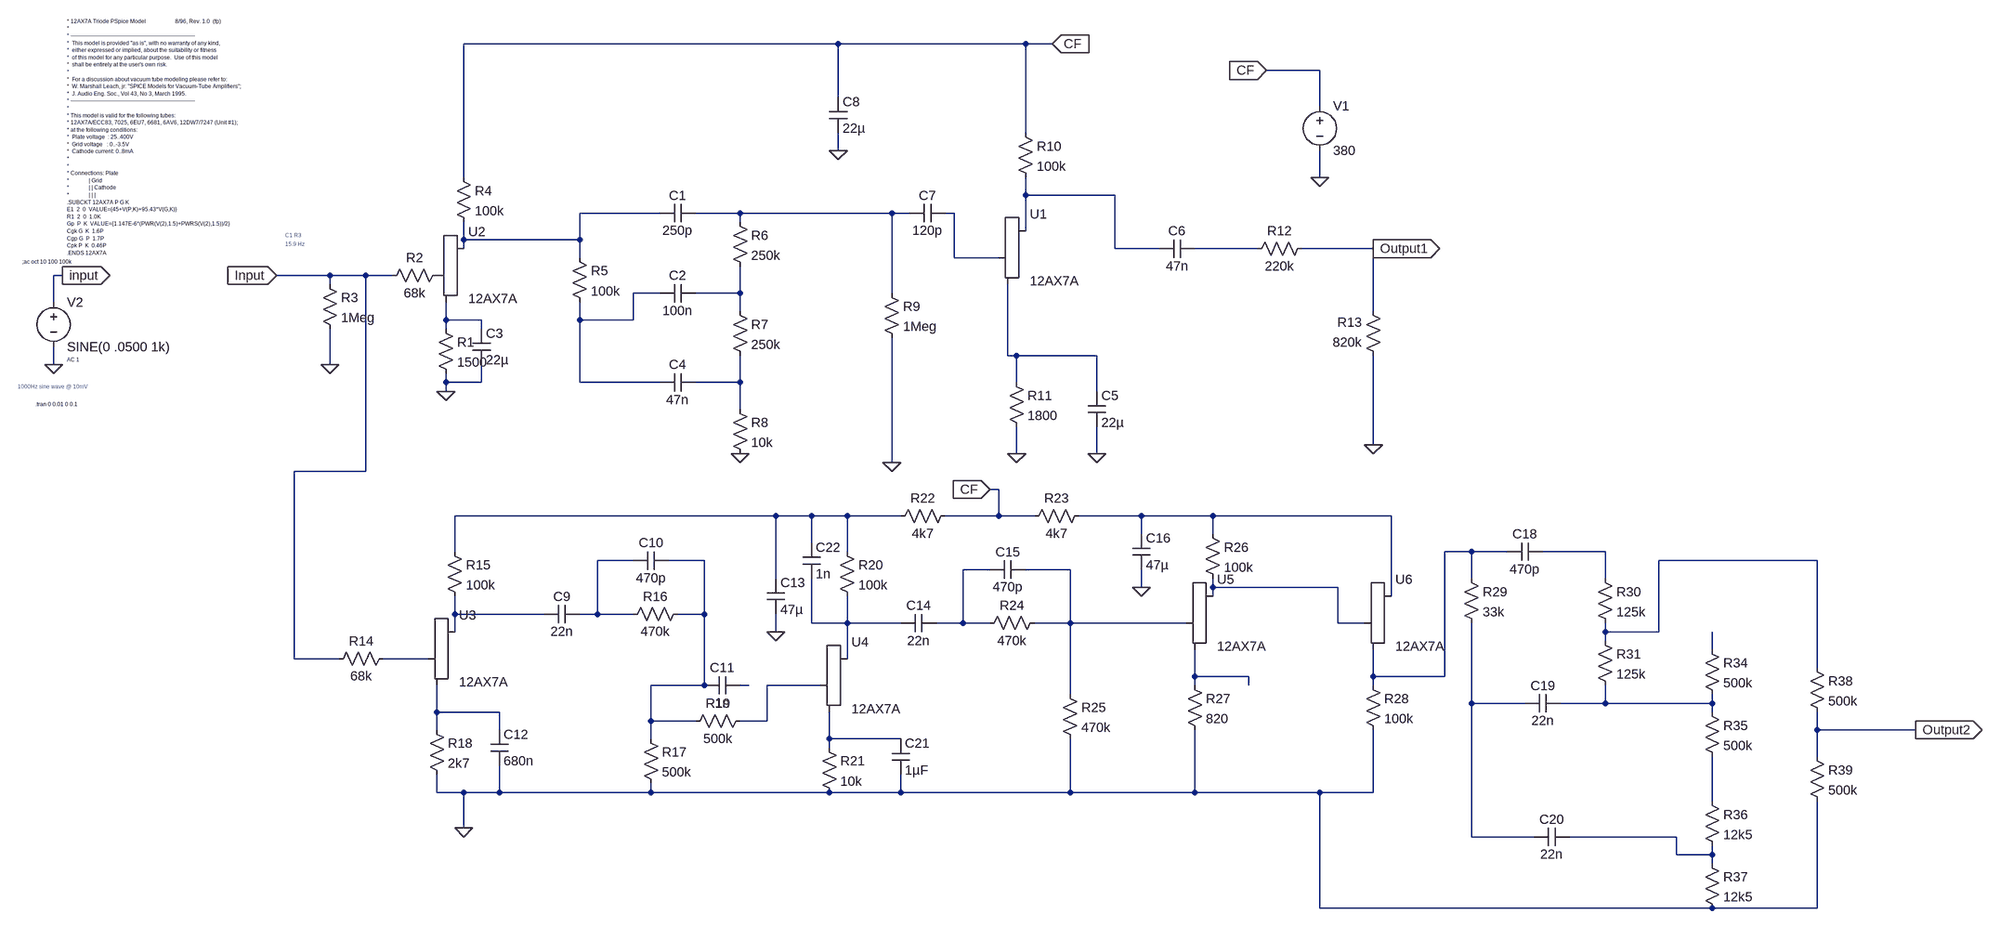
[diagram p0: schematic AAA_preamp1 v3 sin mods.asc]
AAA_preamp1 v3 sin mods.asc, the LTspice schematic file:
Version 4
SHEET 1 3276 1272
WIRE 1120 -288 448 -288
WIRE 1456 -288 1120 -288
WIRE 1504 -288 1456 -288
WIRE 1984 -240 1888 -240
WIRE 1120 -192 1120 -288
WIRE 1984 -176 1984 -240
WIRE 1456 -128 1456 -288
WIRE 1120 -96 1120 -128
WIRE 448 -48 448 -288
WIRE 1984 -48 1984 -96
WIRE 1456 -16 1456 -48
WIRE 1616 -16 1456 -16
WIRE 800 16 656 16
WIRE 944 16 864 16
WIRE 1216 16 944 16
WIRE 1248 16 1216 16
WIRE 1328 16 1312 16
WIRE 944 32 944 16
WIRE 1456 48 1456 -16
WIRE 448 64 448 32
WIRE 656 64 656 16
WIRE 656 64 448 64
WIRE 448 80 448 64
WIRE 1616 80 1616 -16
WIRE 1696 80 1616 80
WIRE 1872 80 1760 80
WIRE 2080 80 1952 80
WIRE 656 96 656 64
WIRE 1328 96 1328 16
WIRE 1408 96 1328 96
WIRE -272 128 -288 128
WIRE 208 128 112 128
WIRE 272 128 208 128
WIRE 320 128 272 128
WIRE 208 144 208 128
WIRE 800 160 752 160
WIRE 944 160 944 112
WIRE 944 160 864 160
WIRE 1216 160 1216 16
WIRE -288 176 -288 128
WIRE 944 192 944 160
WIRE 2080 192 2080 80
WIRE 416 208 416 176
WIRE 480 208 416 208
WIRE 656 208 656 176
WIRE 752 208 752 160
WIRE 752 208 656 208
WIRE 416 224 416 208
WIRE 480 224 480 208
WIRE 1424 272 1424 144
WIRE 1440 272 1424 272
WIRE 1584 272 1440 272
WIRE -288 288 -288 256
WIRE 208 288 208 224
WIRE 416 320 416 304
WIRE 480 320 480 288
WIRE 480 320 416 320
WIRE 656 320 656 208
WIRE 800 320 656 320
WIRE 944 320 944 272
WIRE 944 320 864 320
WIRE 1440 320 1440 272
WIRE 416 336 416 320
WIRE 1584 336 1584 272
WIRE 944 368 944 320
WIRE 2080 432 2080 272
WIRE 1440 448 1440 400
WIRE 1584 448 1584 400
WIRE 1216 464 1216 240
WIRE 272 480 272 128
WIRE 272 480 144 480
WIRE 1408 512 1392 512
WIRE 1008 560 432 560
WIRE 1072 560 1008 560
WIRE 1136 560 1072 560
WIRE 1232 560 1136 560
WIRE 1408 560 1408 512
WIRE 1408 560 1312 560
WIRE 1472 560 1408 560
WIRE 1664 560 1552 560
WIRE 1792 560 1664 560
WIRE 2112 560 1792 560
WIRE 1664 592 1664 560
WIRE 1792 592 1792 560
WIRE 1072 608 1072 560
WIRE 432 624 432 560
WIRE 1136 624 1136 560
WIRE 2256 624 2208 624
WIRE 2320 624 2256 624
WIRE 2496 624 2384 624
WIRE 752 640 688 640
WIRE 880 640 816 640
WIRE 2928 640 2592 640
WIRE 1392 656 1344 656
WIRE 1536 656 1456 656
WIRE 1008 672 1008 560
WIRE 2256 672 2256 624
WIRE 2496 672 2496 624
WIRE 1664 688 1664 656
WIRE 1792 688 1792 672
WIRE 2016 688 1792 688
WIRE 1792 704 1792 688
WIRE 2112 704 2112 560
WIRE 432 736 432 704
WIRE 592 736 432 736
WIRE 688 736 688 640
WIRE 688 736 656 736
WIRE 752 736 688 736
WIRE 880 736 880 640
WIRE 880 736 832 736
WIRE 1072 752 1072 672
WIRE 1136 752 1136 704
WIRE 1136 752 1072 752
WIRE 1232 752 1136 752
WIRE 1344 752 1344 656
WIRE 1344 752 1296 752
WIRE 1392 752 1344 752
WIRE 1536 752 1536 656
WIRE 1536 752 1472 752
WIRE 1744 752 1536 752
WIRE 2016 752 2016 688
WIRE 2064 752 2016 752
WIRE 432 768 432 736
WIRE 1008 768 1008 736
WIRE 2496 768 2496 752
WIRE 2592 768 2592 640
WIRE 2592 768 2496 768
WIRE 2496 784 2496 768
WIRE 2688 800 2688 768
WIRE 144 816 144 480
WIRE 224 816 144 816
WIRE 384 816 304 816
WIRE 1136 816 1136 752
WIRE 2928 832 2928 640
WIRE 1760 848 1760 800
WIRE 1856 848 1760 848
WIRE 2080 848 2080 800
WIRE 2208 848 2208 624
WIRE 2208 848 2080 848
WIRE 880 864 880 736
WIRE 880 864 784 864
WIRE 960 864 944 864
WIRE 1088 864 992 864
WIRE 1760 864 1760 848
WIRE 1856 864 1856 848
WIRE 2080 864 2080 848
WIRE 1536 880 1536 752
WIRE 2256 896 2256 752
WIRE 2352 896 2256 896
WIRE 2496 896 2496 864
WIRE 2496 896 2416 896
WIRE 2688 896 2688 880
WIRE 2688 896 2496 896
WIRE 400 912 400 864
WIRE 512 912 400 912
WIRE 2688 912 2688 896
WIRE 784 928 784 864
WIRE 864 928 784 928
WIRE 992 928 992 864
WIRE 992 928 944 928
WIRE 400 944 400 912
WIRE 512 944 512 912
WIRE 2928 944 2928 912
WIRE 3120 944 3120 928
WIRE 3120 944 2928 944
WIRE 784 960 784 928
WIRE 1104 960 1104 912
WIRE 1232 960 1104 960
WIRE 1104 976 1104 960
WIRE 2928 992 2928 944
WIRE 400 1056 400 1024
WIRE 448 1056 400 1056
WIRE 512 1056 512 1008
WIRE 512 1056 448 1056
WIRE 784 1056 784 1040
WIRE 784 1056 512 1056
WIRE 1104 1056 784 1056
WIRE 1232 1056 1232 1024
WIRE 1232 1056 1104 1056
WIRE 1536 1056 1536 960
WIRE 1536 1056 1232 1056
WIRE 1760 1056 1760 944
WIRE 1760 1056 1536 1056
WIRE 1984 1056 1760 1056
WIRE 2080 1056 2080 944
WIRE 2080 1056 1984 1056
WIRE 2688 1072 2688 992
WIRE 448 1120 448 1056
WIRE 2256 1136 2256 896
WIRE 2368 1136 2256 1136
WIRE 2624 1136 2432 1136
WIRE 2624 1168 2624 1136
WIRE 2688 1168 2688 1152
WIRE 2688 1168 2624 1168
WIRE 2688 1184 2688 1168
WIRE 1984 1264 1984 1056
WIRE 2688 1264 1984 1264
WIRE 2928 1264 2928 1072
WIRE 2928 1264 2688 1264
FLAG 208 288 0
FLAG -288 288 0
FLAG 416 336 0
FLAG -272 128 input
IOPIN -272 128 Out
FLAG 112 128 Input
IOPIN 112 128 In
FLAG 944 448 0
FLAG 1216 464 0
FLAG 1440 448 0
FLAG 1584 448 0
FLAG 2080 432 0
FLAG 2080 80 Output1
IOPIN 2080 80 Out
FLAG 1984 -48 0
FLAG 1120 -96 0
FLAG 1888 -240 CF
IOPIN 1888 -240 In
FLAG 1504 -288 CF
IOPIN 1504 -288 In
FLAG 448 1120 0
FLAG 1008 768 0
FLAG 1392 512 CF
IOPIN 1392 512 In
FLAG 1664 688 0
FLAG 3120 944 Output2
IOPIN 3120 944 Out
SYMBOL Misc\\triode 448 128 R0
SYMATTR InstName U2
SYMATTR Value 12AX7A
SYMBOL res 400 208 R0
SYMATTR InstName R1
SYMATTR Value 1500
SYMBOL res 192 128 R0
SYMATTR InstName R3
SYMATTR Value 1Meg
SYMBOL voltage -288 160 R0
WINDOW 123 24 120 Left 0
WINDOW 39 0 0 Left 0
SYMATTR Value2 AC 1
SYMATTR InstName V2
SYMATTR Value SINE(0 .0500 1k)
SYMBOL cap 464 224 R0
SYMATTR InstName C3
SYMATTR Value 22µ
SYMBOL res 416 112 R90
WINDOW 0 0 56 VBottom 2
WINDOW 3 32 56 VTop 2
SYMATTR InstName R2
SYMATTR Value 68k
SYMBOL res 432 -64 R0
SYMATTR InstName R4
SYMATTR Value 100k
SYMBOL res 640 80 R0
SYMATTR InstName R5
SYMATTR Value 100k
SYMBOL cap 864 0 R90
WINDOW 0 0 32 VBottom 2
WINDOW 3 32 32 VTop 2
SYMATTR InstName C1
SYMATTR Value 250p
SYMBOL cap 864 144 R90
WINDOW 0 0 32 VBottom 2
WINDOW 3 32 32 VTop 2
SYMATTR InstName C2
SYMATTR Value 100n
SYMBOL cap 864 304 R90
WINDOW 0 0 32 VBottom 2
WINDOW 3 32 32 VTop 2
SYMATTR InstName C4
SYMATTR Value 47n
SYMBOL res 928 16 R0
SYMATTR InstName R6
SYMATTR Value 250k
SYMBOL res 928 176 R0
SYMATTR InstName R7
SYMATTR Value 250k
SYMBOL res 928 352 R0
SYMATTR InstName R8
SYMATTR Value 10k
SYMBOL res 1200 144 R0
SYMATTR InstName R9
SYMATTR Value 1Meg
SYMBOL Misc\\triode 1456 96 R0
SYMATTR InstName U1
SYMATTR Value 12AX7A
SYMBOL res 1440 -144 R0
SYMATTR InstName R10
SYMATTR Value 100k
SYMBOL res 1424 304 R0
SYMATTR InstName R11
SYMATTR Value 1800
SYMBOL cap 1568 336 R0
SYMATTR InstName C5
SYMATTR Value 22µ
SYMBOL cap 1760 64 R90
WINDOW 0 0 32 VBottom 2
WINDOW 3 32 32 VTop 2
SYMATTR InstName C6
SYMATTR Value 47n
SYMBOL res 1968 64 R90
WINDOW 0 0 56 VBottom 2
WINDOW 3 32 56 VTop 2
SYMATTR InstName R12
SYMATTR Value 220k
SYMBOL res 2096 288 R180
WINDOW 0 36 76 Left 2
WINDOW 3 36 40 Left 2
SYMATTR InstName R13
SYMATTR Value 820k
SYMBOL cap 1312 0 R90
WINDOW 0 0 32 VBottom 2
WINDOW 3 32 32 VTop 2
SYMATTR InstName C7
SYMATTR Value 120p
SYMBOL voltage 1984 -192 R0
WINDOW 123 0 0 Left 0
WINDOW 39 0 0 Left 0
SYMATTR InstName V1
SYMATTR Value 380
SYMBOL cap 1104 -192 R0
SYMATTR InstName C8
SYMATTR Value 22µ
SYMBOL Misc\\triode 432 816 R0
SYMATTR InstName U3
SYMATTR Value 12AX7A
SYMBOL res 320 800 R90
WINDOW 0 0 56 VBottom 2
WINDOW 3 32 56 VTop 2
SYMATTR InstName R14
SYMATTR Value 68k
SYMBOL res 416 608 R0
SYMATTR InstName R15
SYMATTR Value 100k
SYMBOL res 848 720 R90
WINDOW 0 0 56 VBottom 2
WINDOW 3 32 56 VTop 2
SYMATTR InstName R16
SYMATTR Value 470k
SYMBOL cap 656 720 R90
WINDOW 0 0 32 VBottom 2
WINDOW 3 32 32 VTop 2
SYMATTR InstName C9
SYMATTR Value 22n
SYMBOL cap 816 624 R90
WINDOW 0 0 32 VBottom 2
WINDOW 3 32 32 VTop 2
SYMATTR InstName C10
SYMATTR Value 470p
SYMBOL cap 944 848 R90
WINDOW 0 0 32 VBottom 2
WINDOW 3 32 32 VTop 2
SYMATTR InstName C11
SYMATTR Value 1n
SYMBOL res 768 944 R0
SYMATTR InstName R17
SYMATTR Value 500k
SYMBOL res 384 928 R0
SYMATTR InstName R18
SYMATTR Value 2k7
SYMBOL cap 496 944 R0
SYMATTR InstName C12
SYMATTR Value 680n
SYMBOL cap 992 672 R0
SYMATTR InstName C13
SYMATTR Value 47µ
SYMBOL Misc\\triode 1136 864 R0
SYMATTR InstName U4
SYMATTR Value 12AX7A
SYMBOL res 960 912 R90
WINDOW 0 0 56 VBottom 2
WINDOW 3 32 56 VTop 2
SYMATTR InstName R19
SYMATTR Value 500k
SYMBOL res 1120 608 R0
SYMATTR InstName R20
SYMATTR Value 100k
SYMBOL res 1088 960 R0
SYMATTR InstName R21
SYMATTR Value 10k
SYMBOL res 1328 544 R90
WINDOW 0 0 56 VBottom 2
WINDOW 3 32 56 VTop 2
SYMATTR InstName R22
SYMATTR Value 4k7
SYMBOL res 1568 544 R90
WINDOW 0 0 56 VBottom 2
WINDOW 3 32 56 VTop 2
SYMATTR InstName R23
SYMATTR Value 4k7
SYMBOL cap 1296 736 R90
WINDOW 0 0 32 VBottom 2
WINDOW 3 32 32 VTop 2
SYMATTR InstName C14
SYMATTR Value 22n
SYMBOL res 1488 736 R90
WINDOW 0 0 56 VBottom 2
WINDOW 3 32 56 VTop 2
SYMATTR InstName R24
SYMATTR Value 470k
SYMBOL cap 1456 640 R90
WINDOW 0 0 32 VBottom 2
WINDOW 3 32 32 VTop 2
SYMATTR InstName C15
SYMATTR Value 470p
SYMBOL res 1520 864 R0
SYMATTR InstName R25
SYMATTR Value 470k
SYMBOL cap 1648 592 R0
SYMATTR InstName C16
SYMATTR Value 47µ
SYMBOL Misc\\triode 1792 752 R0
SYMATTR InstName U5
SYMATTR Value 12AX7A
SYMBOL res 1776 576 R0
SYMATTR InstName R26
SYMATTR Value 100k
SYMBOL res 1744 848 R0
SYMATTR InstName R27
SYMATTR Value 820
SYMBOL Misc\\triode 2112 752 R0
SYMATTR InstName U6
SYMATTR Value 12AX7A
SYMBOL res 2064 848 R0
SYMATTR InstName R28
SYMATTR Value 100k
SYMBOL res 2240 656 R0
SYMATTR InstName R29
SYMATTR Value 33k
SYMBOL res 2480 656 R0
SYMATTR InstName R30
SYMATTR Value 125k
SYMBOL res 2480 768 R0
SYMATTR InstName R31
SYMATTR Value 125k
SYMBOL cap 2384 608 R90
WINDOW 0 0 32 VBottom 2
WINDOW 3 32 32 VTop 2
SYMATTR InstName C18
SYMATTR Value 470p
SYMBOL cap 2416 880 R90
WINDOW 0 0 32 VBottom 2
WINDOW 3 32 32 VTop 2
SYMATTR InstName C19
SYMATTR Value 22n
SYMBOL cap 2432 1120 R90
WINDOW 0 0 32 VBottom 2
WINDOW 3 32 32 VTop 2
SYMATTR InstName C20
SYMATTR Value 22n
SYMBOL res 2672 784 R0
SYMATTR InstName R34
SYMATTR Value 500k
SYMBOL res 2672 896 R0
SYMATTR InstName R35
SYMATTR Value 500k
SYMBOL res 2672 1056 R0
SYMATTR InstName R36
SYMATTR Value 12k5
SYMBOL res 2672 1168 R0
SYMATTR InstName R37
SYMATTR Value 12k5
SYMBOL res 2912 816 R0
SYMATTR InstName R38
SYMATTR Value 500k
SYMBOL res 2912 976 R0
SYMATTR InstName R39
SYMATTR Value 500k
SYMBOL cap 1216 960 R0
SYMATTR InstName C21
SYMATTR Value 1µF
SYMBOL cap 1056 608 R0
SYMATTR InstName C22
SYMATTR Value 1n
TEXT -264 -328 Left 0 !* 12AX7A Triode PSpice Model                     8/96, Rev. 1.0  (fp)\n*\n* -------------------------------------------------------------------\n*  This model is provided "as is", with no warranty of any kind,\n*  either expressed or implied, about the suitability or fitness\n*  of this model for any particular purpose.  Use of this model\n*  shall be entirely at the user's own risk.\n*\n*  For a discussion about vacuum tube modeling please refer to:\n*  W. Marshall Leach, jr: "SPICE Models for Vacuum-Tube Amplifiers";\n*  J. Audio Eng. Soc., Vol 43, No 3, March 1995.\n* -------------------------------------------------------------------\n*\n* This model is valid for the following tubes:\n* 12AX7A/ECC83, 7025, 6EU7, 6681, 6AV6, 12DW7/7247 (Unit #1);\n* at the following conditions:\n*  Plate voltage  : 25..400V\n*  Grid voltage   : 0..-3.5V\n*  Cathode current: 0..8mA\n*\n*\n* Connections: Plate\n*              | Grid\n*              | | Cathode\n*              | | |\n.SUBCKT 12AX7A P G K\nE1  2  0  VALUE={45+V(P,K)+95.43*V(G,K)}\nR1  2  0  1.0K\nGp  P  K  VALUE={1.147E-6*(PWR(V(2),1.5)+PWRS(V(2),1.5))/2}\nCgk G  K  1.6P\nCgp G  P  1.7P\nCpk P  K  0.46P\n.ENDS 12AX7A
TEXT -352 328 Left 0 ;1000Hz sine wave @ 10mV
TEXT -320 360 Left 0 !.tran 0 0.01 0 0.1
TEXT 128 72 Left 0 ;15.9 Hz
TEXT 128 56 Left 0 ;C1 R3
TEXT -344 104 Left 0 !;ac oct 10 100 100k

The netlist it stands for:
* AAA_preamp1 v3 sin mods.asc
XU2 N002 P001 N008 12AX7A
R1 N008 0 1500
R3 input 0 1Meg
V2 input 0 SINE(0 .0500 1k) AC 1
C3 N008 0 22µ
R2 P001 input 68k
R4 CF N002 100k
R5 N002 N006 100k
C1 N003 N002 250p
C2 N007 N006 100n
C4 N010 N006 47n
R6 N003 N007 250k
R7 N007 N010 250k
R8 N010 0 10k
R9 N003 0 1Meg
XU1 N001 N004 N009 12AX7A
R10 CF N001 100k
R11 N009 0 1800
C5 N009 0 22µ
C6 N005 N001 47n
R12 Output1 N005 220k
R13 0 Output1 820k
C7 N004 N003 120p
V1 CF 0 380
C8 CF 0 22µ
XU3 N021 N024 N030 12AX7A
R14 N024 input 68k
R15 N011 N021 100k
R16 N016 N015 470k
C9 N015 N021 22n
C10 N016 N015 470p
C11 N026 N016 1n
R17 N016 0 500k
R18 N030 0 2k7
C12 N030 0 680n
C13 N011 0 47µ
XU4 N022 N027 N031 12AX7A
R19 N027 N016 500k
R20 N011 N022 100k
R21 N031 0 10k
R22 CF N011 4k7
R23 N012 CF 4k7
C14 N018 N022 22n
R24 N019 N018 470k
C15 N019 N018 470p
R25 N019 0 470k
C16 N012 0 47µ
XU5 N020 N019 N025 12AX7A
R26 N012 N020 100k
R27 N025 0 820
XU6 N012 N020 N013 12AX7A
R28 N013 0 100k
R29 N013 N028 33k
R30 N014 N017 125k
R31 N017 N029 125k
C18 N014 N013 470p
C19 N029 N028 22n
C20 N033 N028 22n
R34 N023 N029 500k
R35 N029 N032 500k
R36 N032 N033 12k5
R37 N033 0 12k5
R38 N017 Output2 500k
R39 Output2 0 500k
C21 N031 0 1µF
C22 N011 N022 1n
* 12AX7A Triode PSpice Model                     8/96, Rev. 1.0  (fp)
*
* -------------------------------------------------------------------
*  This model is provided "as is", with no warranty of any kind,
*  either expressed or implied, about the suitability or fitness
*  of this model for any particular purpose.  Use of this model
*  shall be entirely at the user's own risk.
*
*  For a discussion about vacuum tube modeling please refer to:
*  W. Marshall Leach, jr: "SPICE Models for Vacuum-Tube Amplifiers";
*  J. Audio Eng. Soc., Vol 43, No 3, March 1995.
* -------------------------------------------------------------------
*
* This model is valid for the following tubes:
* 12AX7A/ECC83, 7025, 6EU7, 6681, 6AV6, 12DW7/7247 (Unit #1);
* at the following conditions:
*  Plate voltage  : 25..400V
*  Grid voltage   : 0..-3.5V
*  Cathode current: 0..8mA
*
*
* Connections: Plate
*              | Grid
*              | | Cathode
*              | | |
.SUBCKT 12AX7A P G K
E1  2  0  VALUE={45+V(P,K)+95.43*V(G,K)}
R1  2  0  1.0K
Gp  P  K  VALUE={1.147E-6*(PWR(V(2),1.5)+PWRS(V(2),1.5))/2}
Cgk G  K  1.6P
Cgp G  P  1.7P
Cpk P  K  0.46P
.ENDS 12AX7A
* 1000Hz sine wave @ 10mV
.tran 0 0.01 0 0.1
* 15.9 Hz
* C1 R3
;ac oct 10 100 100k
.backanno
.end